# Altium schematic sheet BLDC.SchDoc: BLDC电机驱动
size A3; Author: 周琦; Organization: 模块：电机驱动; Address1: 使用栅极驱动芯片，自带闭锁功能; Address2: 内建死区控制电路; Address3: 使用N-MOS驱动电机; Address4: 适用与三相直流无刷电机; Revision: A01.06; SheetNumber: 2; SheetTotal: 2
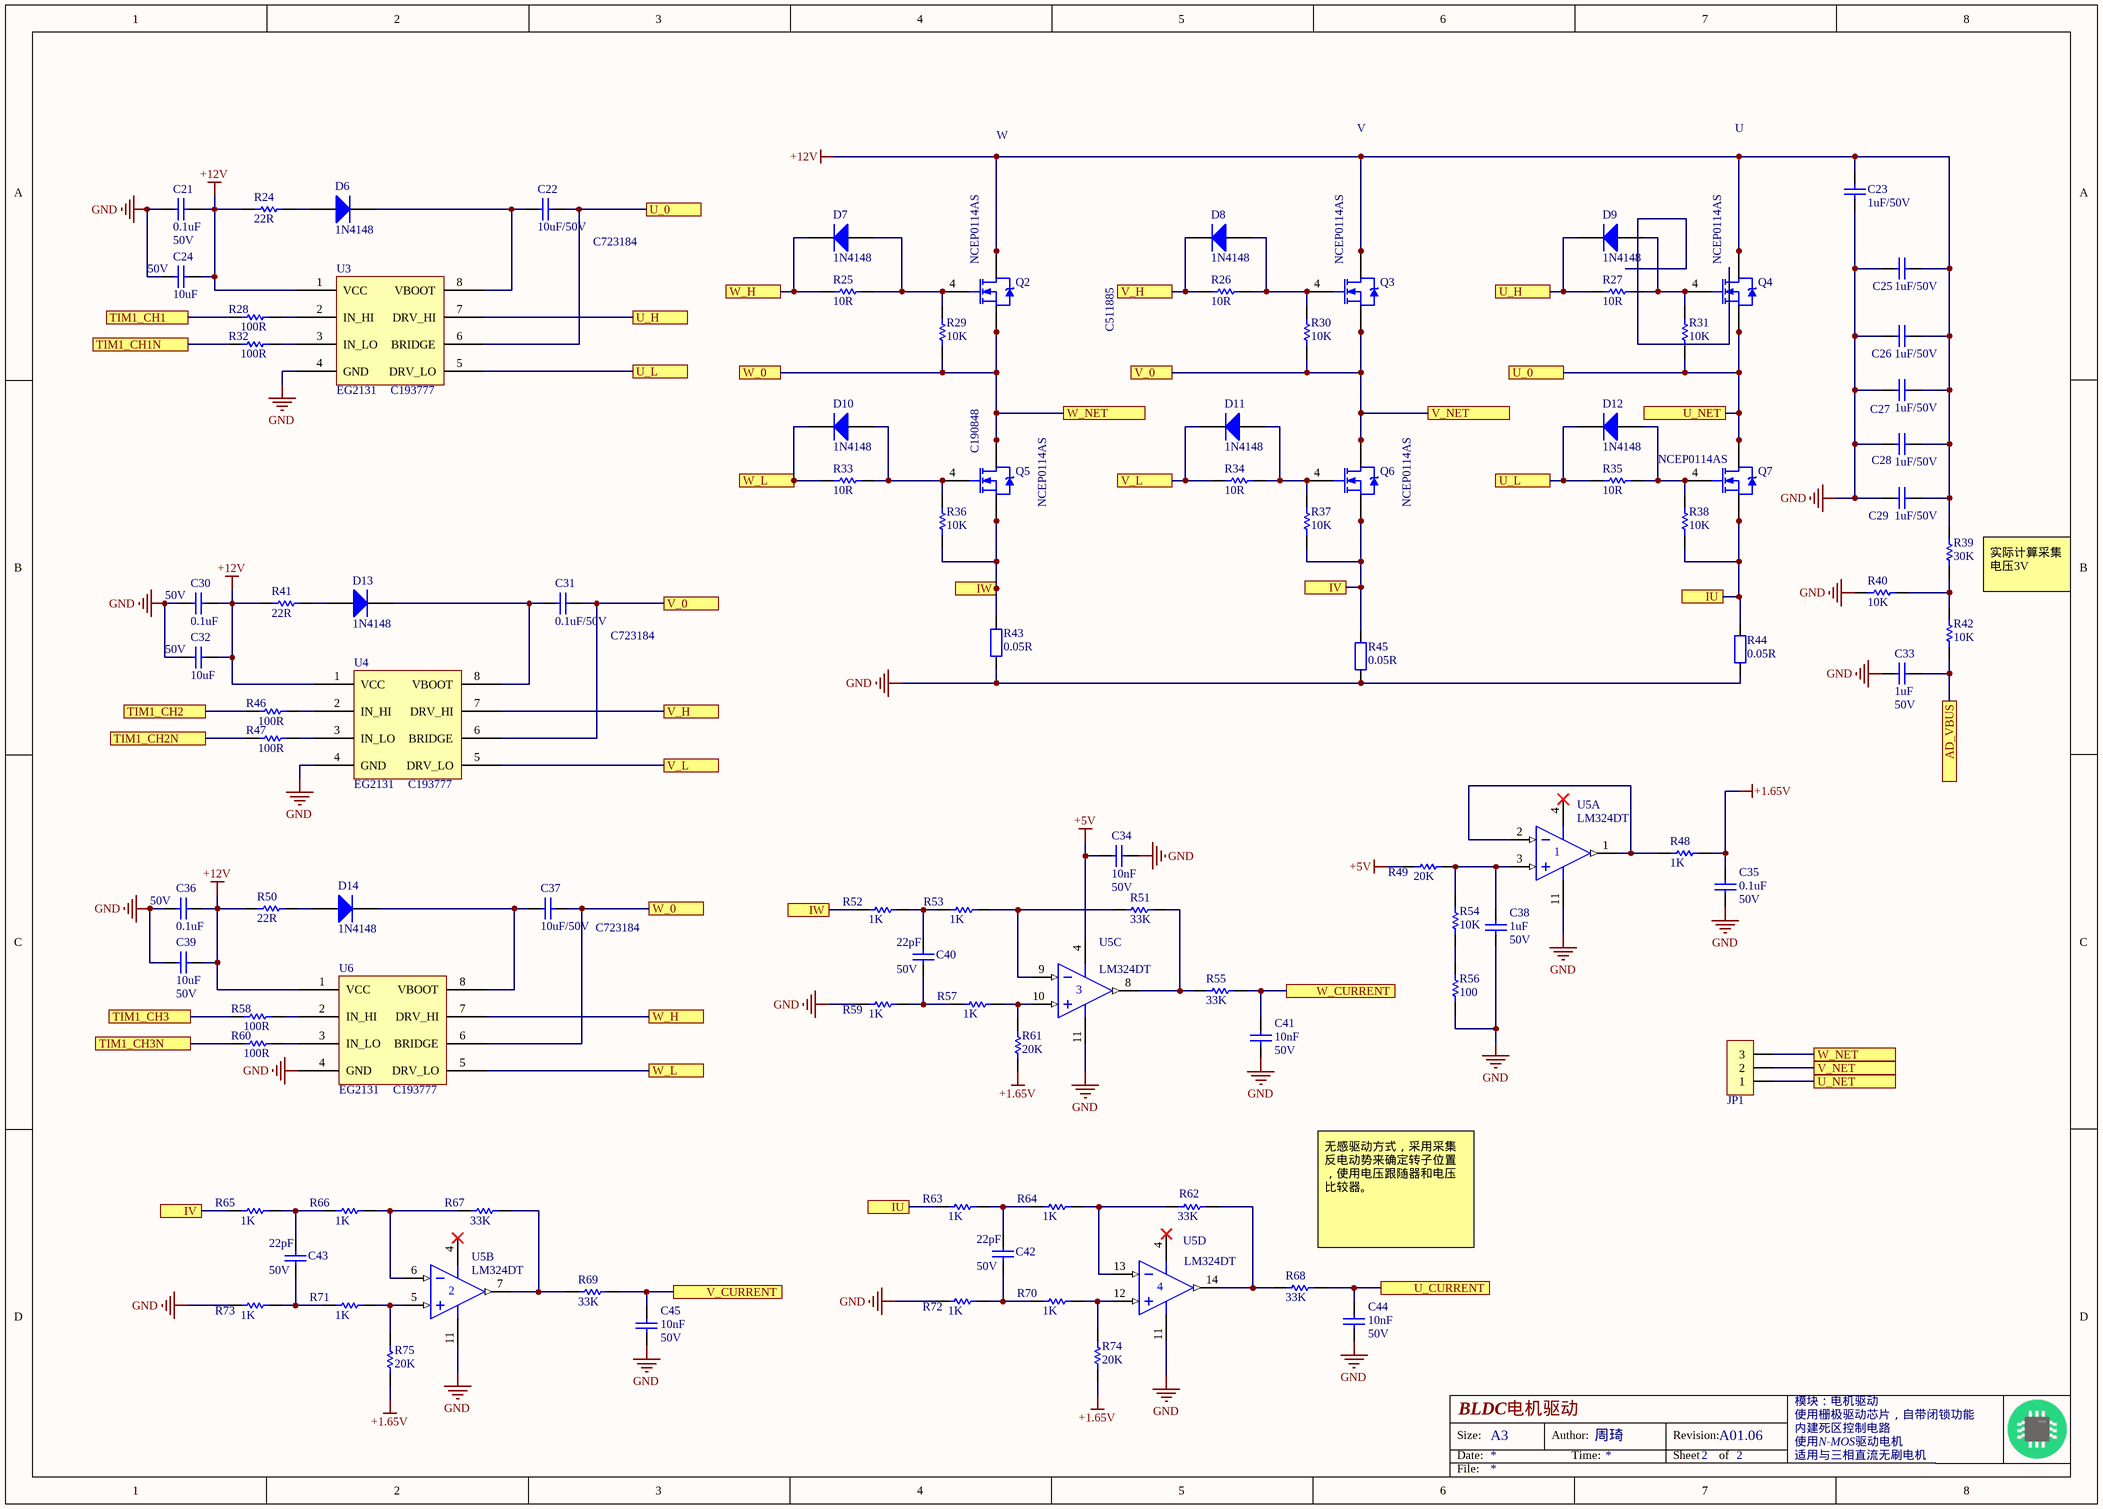
[diagram p0: BLDC.SchDoc]

## Parts
C21  0.1uF  parm: 50V  [C0603_L]
C22  10uF/50V  [C0603_L]
C23  1uF/50V  [C1210_L]
C24  10uF  parm: 50V  [C0805_L]
C25  1uF/50V  [C1210_L]
C26  1uF/50V  [C1210_L]
C27  1uF/50V  [C1210_L]
C28  1uF/50V  [C1210_L]
C29  1uF/50V  [C1210_L]
C30  0.1uF  parm: 50V  [C0603_L]
C31  0.1uF/50V  [C0603_L]
C32  10uF  parm: 50V  [C0805_L]
C33  1uF  parm: 50V  [C0603_L]
C34  10nF  parm: 50V  [C0603_L]
C35  0.1uF  parm: 50V  [C0603_L]
C36  0.1uF  parm: 50V  [C0603_L]
C37  10uF/50V  [C0603_L]
C38  1uF  parm: 50V  [C0603_L]
C39  10uF  parm: 50V  [C0805_L]
C40  22pF  parm: 50V  [C0603_L]
C41  10nF  parm: 50V  [C0603_L]
C42  22pF  parm: 50V  [C0603_L]
C43  22pF  parm: 50V  [C0603_L]
C44  10nF  parm: 50V  [C0603_L]
C45  10nF  parm: 50V  [C0603_L]
D6  1N4148  [SOD-123]
D7  1N4148  [SOD-123]
D8  1N4148  [SOD-123]
D9  1N4148  [SOD-123]
D10  1N4148  [SOD-123]
D11  1N4148  [SOD-123]
D12  1N4148  [SOD-123]
D13  1N4148  [SOD-123]
D14  1N4148  [SOD-123]
JP1  HDR-1X3  [KF350-3P]  (value not drawn)
Q2  NCEP0114AS  [SOP8]
Q3  NCEP0114AS  [SOP8]
Q4  NCEP0114AS  [SOP8]
Q5  NCEP0114AS  [SOP8]
Q6  NCEP0114AS  [SOP8]
Q7  NCEP0114AS  [SOP8]
R24  22R  [R0603_L]
R25  10R  [R0603_L]
R26  10R  [R0603_L]
R27  10R  [R0603_L]
R28  100R  [R0603_L]
R29  10K  [R0603_L]
R30  10K  [R0603_L]
R31  10K  [R0603_L]
R32  100R  [R0603_L]
R33  10R  [R0603_L]
R34  10R  [R0603_L]
R35  10R  [R0603_L]
R36  10K  [R0603_L]
R37  10K  [R0603_L]
R38  10K  [R0603_L]
R39  30K  [R0603_L]
R40  10K  [R0603_L]
R41  22R  [R0603_L]
R42  10K  [R0603_L]
R43  0.05R  [R2512_L]
R44  0.05R  [R2512_L]
R45  0.05R  [R2512_L]
R46  100R  [R0603_L]
R47  100R  [R0603_L]
R48  1K  [R0603_L]
R49  20K  [R0603_L]
R50  22R  [R0603_L]
R51  33K  [R0603_L]
R52  1K  [R0603_L]
R53  1K  [R0603_L]
R54  10K  [R0603_L]
R55  33K  [R0603_L]
R56  100  [R0603_L]
R57  1K  [R0603_L]
R58  100R  [R0603_L]
R59  1K  [R0603_L]
R60  100R  [R0603_L]
R61  20K  [R0603_L]
R62  33K  [R0603_L]
R63  1K  [R0603_L]
R64  1K  [R0603_L]
R65  1K  [R0603_L]
R66  1K  [R0603_L]
R67  33K  [R0603_L]
R68  33K  [R0603_L]
R69  33K  [R0603_L]
R70  1K  [R0603_L]
R71  1K  [R0603_L]
R72  1K  [R0603_L]
R73  1K  [R0603_L]
R74  20K  [R0603_L]
R75  20K  [R0603_L]
U3  EG2131  [SOP8]
U4  EG2131  [SOP8]
U5  LM324DT  [SOIC-14]  (parts A,B,C,D of 4)
U6  EG2131  [SOP8]

## Ports
AD_VBUS, IU, IV, IW, TIM1_CH1, TIM1_CH1N, TIM1_CH2, TIM1_CH2N, TIM1_CH3, TIM1_CH3N, U_0, U_CURRENT, U_H, U_L, U_NET, V_0, V_CURRENT, V_H, V_L, V_NET, W_0, W_CURRENT, W_H, W_L, W_NET

## Nets
+1.65V: C35.2 R48.1 R61.1 R74.1 R75.1
+5V: C34.2 R49.1 U5.4(V+)
+12V: C21.1 C23.1 C24.1 C25.1 C26.1 C27.1 C28.1 C29.1 C30.1 C32.1 C36.1 C39.1 Q2.5(D) Q2.6(D) Q2.7(D) Q2.8(D) Q3.5(D) Q3.6(D) Q3.7(D) Q3.8(D) Q4.5(D) Q4.6(D) Q4.7(D) Q4.8(D) R24.1 R39.2 R41.1 R50.1 U3.1(VCC) U4.1(VCC) U6.1(VCC)
GND: C21.2 C23.2 C24.2 C25.2 C26.2 C27.2 C28.2 C29.2 C30.2 C32.2 C33.1 C34.1 C35.1 C36.2 C38.1 C39.2 C41.1 C44.1 C45.1 R40.2 R43.1 R44.1 R45.1 R56.1 R59.1 R72.1 R73.1 U3.4(GND) U4.4(GND) U5.11(V-) U6.4(GND)
AD_VBUS: C33.2 R42.2 ; port AD_VBUS
IU: Q7.1(S) Q7.2(S) Q7.3(S) R38.1 R44.2 R63.1 ; port IU
IV: Q6.1(S) Q6.2(S) Q6.3(S) R37.1 R45.2 R65.1 ; port IV
IW: Q5.1(S) Q5.2(S) Q5.3(S) R36.1 R43.2 R52.1 ; port IW
TIM1_CH1: R28.1 ; port TIM1_CH1
TIM1_CH1N: R32.1 ; port TIM1_CH1N
TIM1_CH2: R46.1 ; port TIM1_CH2
TIM1_CH2N: R47.1 ; port TIM1_CH2N
TIM1_CH3: R58.1 ; port TIM1_CH3
TIM1_CH3N: R60.1 ; port TIM1_CH3N
U_0: C22.1 JP1.1 Q4.1(S) Q4.2(S) Q4.3(S) Q7.5(D) Q7.6(D) Q7.7(D) Q7.8(D) R31.1 U3.6(BRIDGE) ; port U_0, port U_NET
U_CURRENT: C44.2 R68.1 ; port U_CURRENT
U_H: D9.2(K) R27.1 U3.7(DRV_HI) ; port U_H
U_L: D12.2(K) R35.1 U3.5(DRV_LO) ; port U_L
V_0: C31.1 JP1.2 Q3.1(S) Q3.2(S) Q3.3(S) Q6.5(D) Q6.6(D) Q6.7(D) Q6.8(D) R30.1 U4.6(BRIDGE) ; port V_0, port V_NET
V_CURRENT: C45.2 R69.1 ; port V_CURRENT
V_H: D8.2(K) R26.1 U4.7(DRV_HI) ; port V_H
V_L: D11.2(K) R34.1 U4.5(DRV_LO) ; port V_L
W_0: C37.1 JP1.3 Q2.1(S) Q2.2(S) Q2.3(S) Q5.5(D) Q5.6(D) Q5.7(D) Q5.8(D) R29.1 U6.6(BRIDGE) ; port W_0, port W_NET
W_CURRENT: C41.2 R55.1 ; port W_CURRENT
W_H: D7.2(K) R25.1 U6.7(DRV_HI) ; port W_H
W_L: D10.2(K) R33.1 U6.5(DRV_LO) ; port W_L
NetC22_2: C22.2 D6.2(K) U3.8(VBOOT)
NetC31_2: C31.2 D13.2(K) U4.8(VBOOT)
NetC37_2: C37.2 D14.2(K) U6.8(VBOOT)
NetC38_2: C38.2 R49.2 R54.2 U5.3(IN+)
NetC40_1: C40.1 R52.2 R53.1
NetC40_2: C40.2 R57.1 R59.2
NetC42_1: C42.1 R63.2 R64.1
NetC42_2: C42.2 R70.1 R72.2
NetC43_1: C43.1 R65.2 R66.1
NetC43_2: C43.2 R71.1 R73.2
NetD6_1: D6.1(A) R24.2
NetD7_1: D7.1(A) Q2.4(G) R25.2 R29.2
NetD8_1: D8.1(A) Q3.4(G) R26.2 R30.2
NetD9_1: D9.1(A) Q4.4(G) R27.2 R31.2
NetD10_1: D10.1(A) Q5.4(G) R33.2 R36.2
NetD11_1: D11.1(A) Q6.4(G) R34.2 R37.2
NetD12_1: D12.1(A) Q7.4(G) R35.2 R38.2
NetD13_1: D13.1(A) R41.2
NetD14_1: D14.1(A) R50.2
NetR28_2: R28.2 U3.2(IN_HI)
NetR32_2: R32.2 U3.3(IN_LO)
NetR39_1: R39.1 R40.1 R42.1
NetR46_2: R46.2 U4.2(IN_HI)
NetR47_2: R47.2 U4.3(IN_LO)
NetR48_2: R48.2 U5.1(OUT) U5.2(IN-)
NetR51_1: R51.1 R53.2 U5.9(IN-)
NetR51_2: R51.2 R55.2 U5.8(OUT)
NetR54_1: R54.1 R56.2
NetR57_2: R57.2 R61.2 U5.10(IN+)
NetR58_2: R58.2 U6.2(IN_HI)
NetR60_2: R60.2 U6.3(IN_LO)
NetR62_1: R62.1 R64.2 U5.13(IN-)
NetR62_2: R62.2 R68.2 U5.14(OUT)
NetR66_2: R66.2 R67.1 U5.6(IN-)
NetR67_2: R67.2 R69.2 U5.7(OUT)
NetR70_2: R70.2 R74.2 U5.12(IN+)
NetR71_2: R71.2 R75.2 U5.5(IN+)

## Notes on the sheet
- W
- V
- U
- (near C22) C723184
- C511885
- (near Q5) C190848
- 实际计算采集电压3V
- (near C31) C723184
- (near C37) C723184
- (near R68) 无感驱动方式，采用采集反电动势来确定转子位置，使用电压跟随器和电压比较器。
- Size:
- Date:
- A3
- Author:
- Time:
- Revision:
- Sheet
- of
- File:

## Library data of the parts
C21 C23-C30 C32-C36 C38-C45 = Cap: LC: C1591
C22 C31 C37 = Cap: C89632; LC: C1591; parm: 100V
D6-D14 = SOD-323 1N4148WS T4: 二极管; ComponentLink1Description: 供应商链接; ComponentLink1URL: http://www.szlcsc.com/product/details_2485.html; Package: SOD-323; Supplier: LC; SuppliersPartNumber: C2128
JP1 = Header 3: 3P接插件; 版权归属: 源创客; BOM名称: 3P接插件; 学习资源: www.ooocke.com
Q2-Q7 = NMOS-2: C190848; Note: Pin 2 is electrically connected to pin 4.; Published: 8-Jun-2000; LatestRevisionDate: 17-Jul-2002; LatestRevisionNote: Re-released for DXP Platform.; DatasheetDocument: PD-9.814; PackageReference: TO-220AB; Publisher: 60V; Code_JEDEC: TO-220-AB; ComponentLink1Description: Manufacturer Link; ComponentLink1URL: http://www.irf.com/
R24-R42 R46-R75 = Res1: Resistor; LC: *
R43-R45 = R-I: 电流检测电阻; 版权归属: 源创客; BOM名称: 电流检测电阻; 学习资源: www.ooocke.com
U3 U4 U6 = NCP5106BDR2G: C193777; 编号: C193777
U5 = LM324DT_[C71035]: 运放; ComponentLink1Description: 供应商链接; ComponentLink1URL: http://www.szlcsc.com/product/details_72134.html; Package: SOIC-14_150mil; Supplier: LC; SuppliersPartNumber: C71035